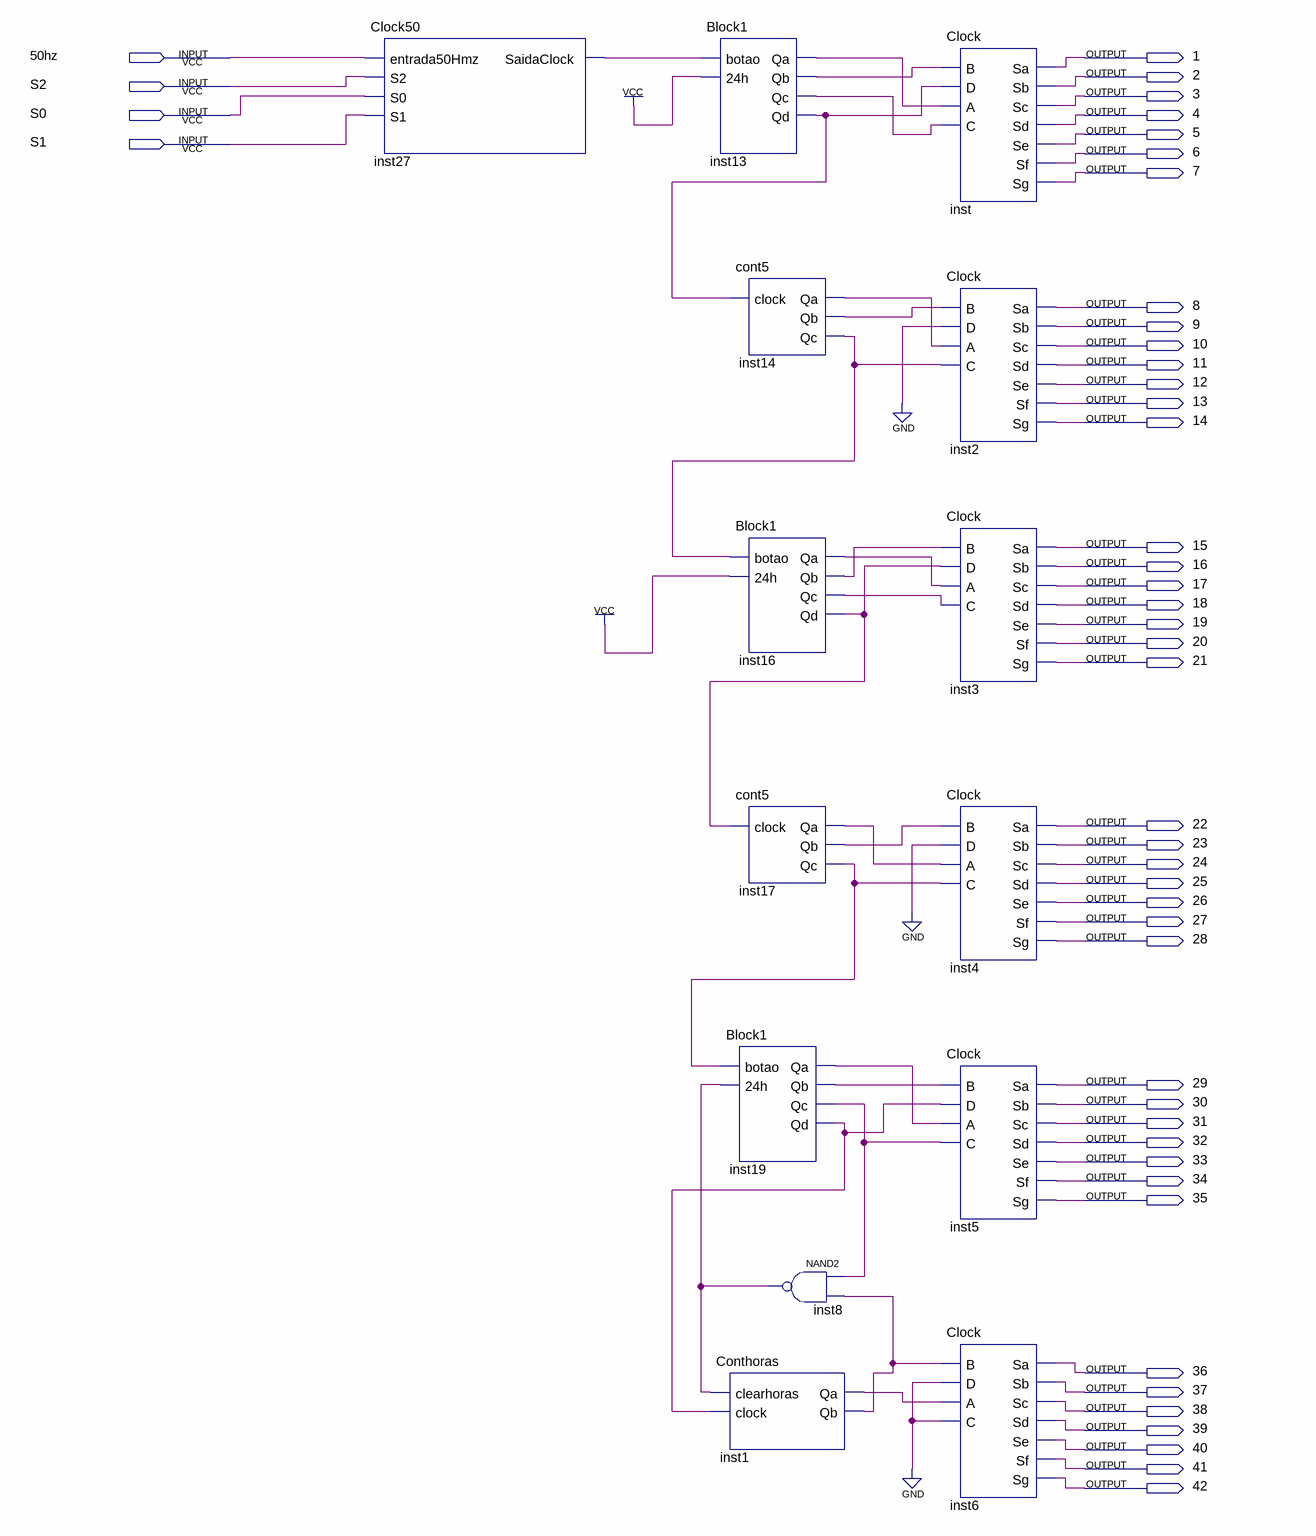
[diagram p0: schematic sheet]
// Quartus schematic Principal.bdf as structural Verilog: 14 symbols, 46 pins
module Principal (
  input  \50hz ,
  input  S2,
  input  S0,
  input  S1,
  output \1 ,
  output \2 ,
  output \3 ,
  output \4 ,
  output \5 ,
  output \6 ,
  output \7 ,
  output \8 ,
  output \9 ,
  output \10 ,
  output \11 ,
  output \12 ,
  output \13 ,
  output \14 ,
  output \15 ,
  output \16 ,
  output \17 ,
  output \18 ,
  output \19 ,
  output \20 ,
  output \21 ,
  output \22 ,
  output \23 ,
  output \24 ,
  output \25 ,
  output \26 ,
  output \27 ,
  output \28 ,
  output \29 ,
  output \30 ,
  output \31 ,
  output \32 ,
  output \33 ,
  output \34 ,
  output \35 ,
  output \36 ,
  output \37 ,
  output \38 ,
  output \39 ,
  output \40 ,
  output \41 ,
  output \42 
);

  wire inst1_qa, inst1_qb, inst8_out, inst13_qa, inst13_qb, inst13_qc, inst13_qd, inst14_qa, inst14_qb,
       inst14_qc, inst16_qa, inst16_qb, inst16_qc, inst16_qd, inst17_qa, inst17_qb, inst17_qc, inst19_qa,
       inst19_qb, inst19_qc, inst19_qd, inst27_saidaclock;

  Clock50 inst27 (.entrada50Hmz(\50hz ), .S2(S2), .S0(S0), .S1(S1), .SaidaClock(inst27_saidaclock));
  Block1 inst13 (
    .botao(inst27_saidaclock), .\24h (1'b1), .Qa(inst13_qa), .Qb(inst13_qb), .Qc(inst13_qc), .Qd(inst13_qd));
  cont5 inst14 (.clock(inst13_qd), .Qa(inst14_qa), .Qb(inst14_qb), .Qc(inst14_qc));
  Block1 inst16 (.botao(inst14_qc), .\24h (1'b1), .Qa(inst16_qa), .Qb(inst16_qb), .Qc(inst16_qc), .Qd(inst16_qd));
  cont5 inst17 (.clock(inst16_qd), .Qa(inst17_qa), .Qb(inst17_qb), .Qc(inst17_qc));
  Block1 inst19 (.botao(inst17_qc), .\24h (inst8_out), .Qa(inst19_qa), .Qb(inst19_qb), .Qc(inst19_qc), .Qd(inst19_qd));
  Conthoras inst1 (.clearhoras(inst8_out), .clock(inst19_qd), .Qa(inst1_qa), .Qb(inst1_qb));
  nand inst8 (inst8_out, inst19_qc, inst1_qb);
  Clock inst (
    .B(inst13_qb), .D(inst13_qd), .A(inst13_qa), .C(inst13_qc), .Sa(\1 ), .Sb(\2 ), .Sc(\3 ), .Sd(\4 ),
    .Se(\5 ), .Sf(\6 ), .Sg(\7 ));
  Clock inst2 (
    .B(inst14_qb), .D(1'b0), .A(inst14_qa), .C(inst14_qc), .Sa(\8 ), .Sb(\9 ), .Sc(\10 ), .Sd(\11 ),
    .Se(\12 ), .Sf(\13 ), .Sg(\14 ));
  Clock inst3 (
    .B(inst16_qb), .D(inst16_qd), .A(inst16_qa), .C(inst16_qc), .Sa(\15 ), .Sb(\16 ), .Sc(\17 ), .Sd(\18 ),
    .Se(\19 ), .Sf(\20 ), .Sg(\21 ));
  Clock inst4 (
    .B(inst17_qb), .D(1'b0), .A(inst17_qa), .C(inst17_qc), .Sa(\22 ), .Sb(\23 ), .Sc(\24 ), .Sd(\25 ),
    .Se(\26 ), .Sf(\27 ), .Sg(\28 ));
  Clock inst5 (
    .B(inst19_qb), .D(inst19_qd), .A(inst19_qa), .C(inst19_qc), .Sa(\29 ), .Sb(\30 ), .Sc(\31 ), .Sd(\32 ),
    .Se(\33 ), .Sf(\34 ), .Sg(\35 ));
  Clock inst6 (
    .B(inst1_qb), .D(1'b0), .A(inst1_qa), .C(1'b0), .Sa(\36 ), .Sb(\37 ), .Sc(\38 ), .Sd(\39 ), .Se(\40 ),
    .Sf(\41 ), .Sg(\42 ));
endmodule
